# EAGLE board base (EAGLE 9.5.1)
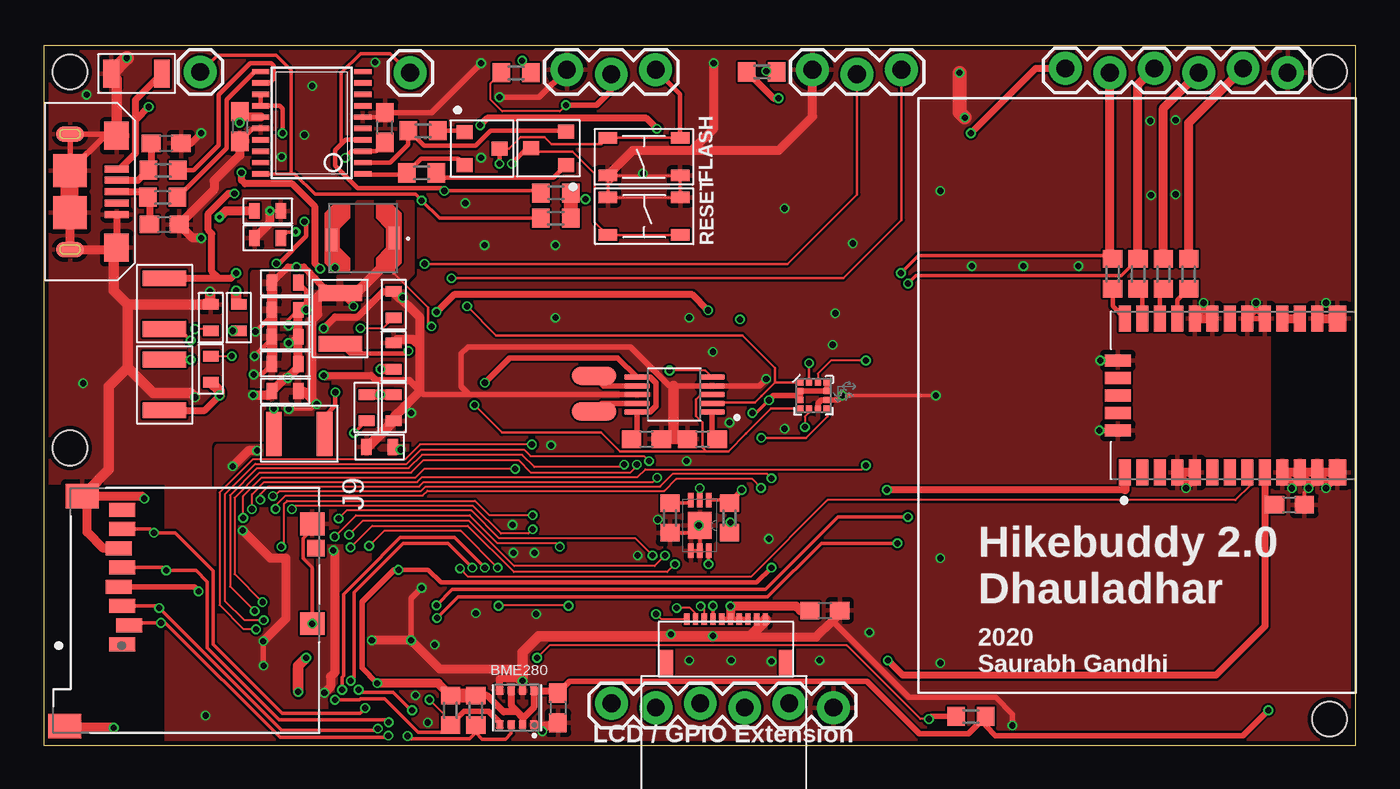
[diagram p2: board, top side]
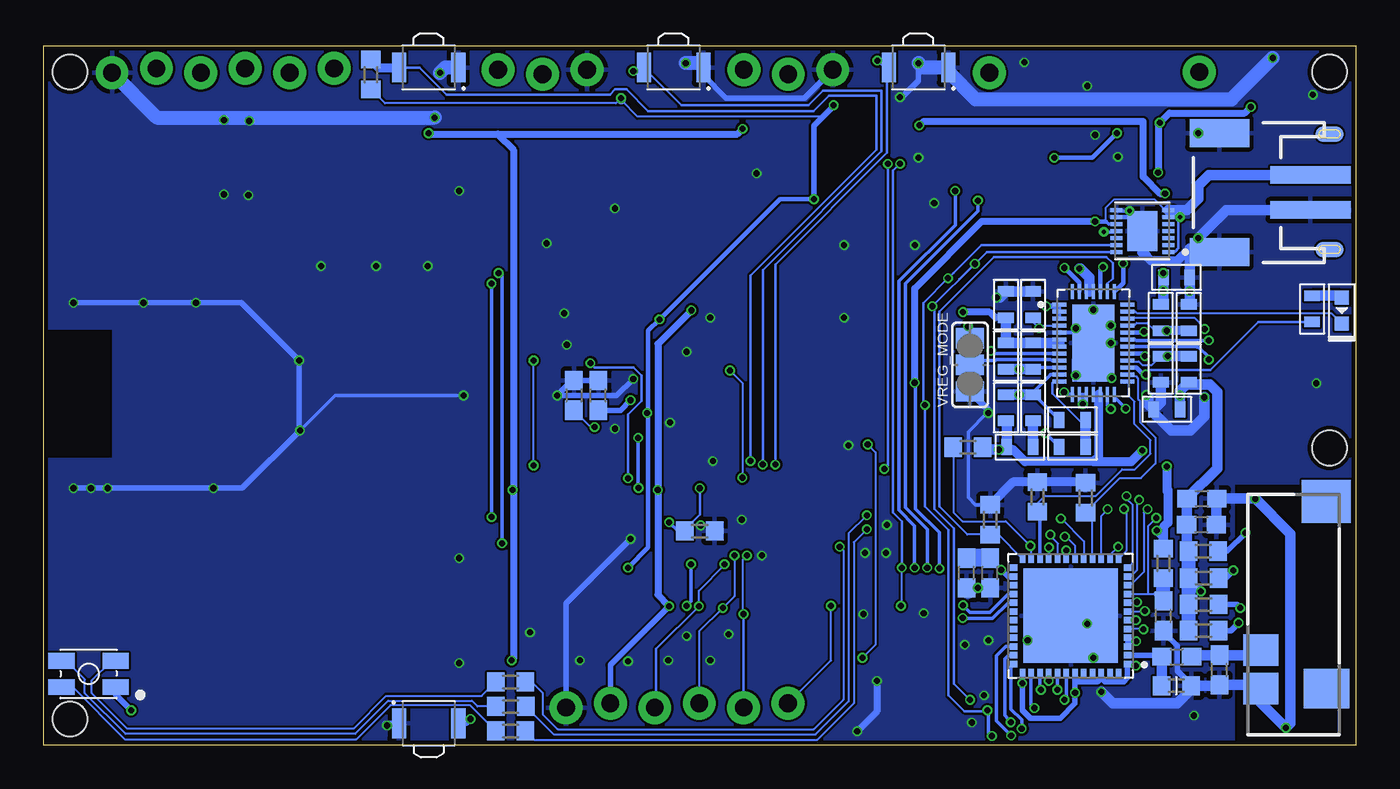
[diagram p3: board, bottom side, seen from below]

Size 75 x 40 mm. Coordinates in mm from the lower left corner, seen from the top.
Outline: 0,0 75,0 75,40 0,40 0,0
Copper layers (1*16): Top 0.035mm / dielectric 1.5mm / Bottom 0.035mm
Design rules "MF_4_mil_drill_2_Layer": minimum track width 5mil, minimum drill 4mil, track to track 5mil, track to pad 5mil, pad to pad 5mil, via to via 5mil, smd to smd 0mil, copper to edge 10mil, drill to drill 10mil, minimum pad ring 4mil, minimum via ring 4mil, stop-mask expansion 2mil, vias tented up to drill 25mil, thermal gap 10mil
Holes 2 mm at 73.5,38.5 73.5,1.5 1.5,38.5 1.5,17
tKeepout: area 71,18 to 75,22
bKeepout: area 71,18 to 75,22

## Footprints (pad centres in the part's own frame; a part is rotated, then mirrored left to right if it is on the bottom)
PRO-OB-440_1 = smd 2 x 1.8: 1 1.865,-2.65; 2 1.865,-4.85 | smd 2.6 x 2.25: 3 -1.865,-2.65 | smd 2.8 x 2.45: 4 -1.865,-13.35
JST-2-SMD = smd 1 x 4.6: 1 -1,-3.7; 2 1,-3.7 | smd 1.6 x 3.4: NC1 -3.4,1.5; NC2 3.4,1.5
PSON65P250X250X100-8N = smd 0.49 x 0.45: 1 0.97,0.975; 2 0.97,0.325; 3 0.97,-0.325; 4 0.97,-0.975; 5 -0.97,-0.975; 6 -0.97,-0.325; 7 -0.97,0.325; 8 -0.97,0.975
C0603 = smd 1.1 x 1: 1 -0.85,0; 2 0.85,0
C1206 = smd 0.9 x 1.6: P$1 -1.45,0; P$2 1.45,0
C0603' = smd 0.6 x 0.9: P$1 -0.75,0; P$2 0.75,0
LED0603 = smd 0.8 x 0.8: ANODE 0.75,0; CATHODE -0.75,0
PLCC4 = smd 1.5 x 0.9: P$1 -1.55,0.75; P$2 -1.55,-0.75; P$3 1.55,-0.75; P$4 1.55,0.75
PQFN50P700X700X104-49N = smd 0.45 x 0.35: 1 -3.265,2.75; 2 -3.265,2.25; 3 -3.265,1.75; 4 -3.265,1.25; 5 -3.265,0.75; 6 -3.265,0.25; 7 -3.265,-0.25; 8 -3.265,-0.75; 9 -3.265,-1.25; 10 -3.265,-1.75; 11 -3.265,-2.25; 12 -3.265,-2.75; 25 3.265,-2.75; 26 3.265,-2.25; 27 3.265,-1.75; 28 3.265,-1.25; 29 3.265,-0.75; 30 3.265,-0.25; 31 3.265,0.25; 32 3.265,0.75; 33 3.265,1.25; 34 3.265,1.75; 35 3.265,2.25; 36 3.265,2.75 | smd 0.35 x 0.45: 13 -2.75,-3.265; 14 -2.25,-3.265; 15 -1.75,-3.265; 16 -1.25,-3.265; 17 -0.75,-3.265; 18 -0.25,-3.265; 19 0.25,-3.265; 20 0.75,-3.265; 21 1.25,-3.265; 22 1.75,-3.265; 23 2.25,-3.265; 24 2.75,-3.265; 37 2.75,3.265; 38 2.25,3.265; 39 1.75,3.265; 40 1.25,3.265; 41 0.75,3.265; 42 0.25,3.265; 43 -0.25,3.265; 44 -0.75,3.265; 45 -1.25,3.265; 46 -1.75,3.265; 47 -2.25,3.265; 48 -2.75,3.265 | smd 5.4 x 5.4: 49 0,0
TACT4.2MM = smd 1.05 x 0.65: P$1 -2.075,1.075; P$2 2.075,1.075; P$3 -2.075,-1.075; P$4 2.075,-1.075
TSSOP20 = smd 0.305 x 0.991: 1 -2.925,-2.918; 2 -2.275,-2.918; 3 -1.625,-2.918; 4 -0.975,-2.918; 5 -0.325,-2.918; 6 0.325,-2.918; 7 0.975,-2.918; 8 1.625,-2.918; 9 2.275,-2.918; 10 2.925,-2.918; 11 2.925,2.918; 12 2.275,2.918; 13 1.625,2.918; 14 0.975,2.918; 15 0.325,2.918; 16 -0.325,2.918; 17 -0.975,2.918; 18 -1.625,2.918; 19 -2.275,2.918; 20 -2.925,2.918
MICROUSB-RIGHT = smd 0.4 x 1.35: 1 -1.3,1.27; 2 -0.65,1.27; 3 0,1.27; 4 0.65,1.27; 5 1.3,1.27 | smd 0.9 x 1.6: S1 -3.3,-1.4; S2 3.3,-1.4 | smd 1.6 x 1.4: S3 -3.2,1.27; S4 3.2,1.27 | smd 1.9 x 1.9: S5 -1.2,-1.405; S6 1.2,-1.405 | smd 0.9 x 1.6 bottom: S7 -3.3,-1.4; S8 3.3,-1.4
1X06_LOCK = drill 1.016 pad 1.88: 1 0,0; 2 2.54,-0.254; 3 5.08,0; 4 7.62,-0.254; 5 10.16,0; 6 12.7,-0.254
1X03_LOCK = drill 1.016 pad 1.88: 1 0,0.127; 2 2.54,-0.127; 3 5.08,0.127
SOLDER_PAD_2 = smd 1.016 x 2.54: P$1 -1.016,0; P$2 1.016,0
1X01 = drill 1.016 pad 1.88: 1 0,0
MOLEX_47352-1001 = smd 0.8 x 1.5: 1 1.94,-3.66; 2 0.84,-3.26; 3 -0.26,-3.66; 4 -1.36,-3.86; 5 -2.46,-3.66; 6 -3.56,-3.86; 7 -4.66,-3.66; 8 -5.76,-3.66 | smd 1.3 x 1.4: S1 -4.95,7.2; S2 0.75,7.2 | smd 1.4 x 1.9: S3 -6.55,-5.95; S4 6.6,-6.95 | smd 0.95 x 1: SW -3.56,7.4
L0603 = smd 1 x 1.1: 1 -0.85,0; 2 0.85,0
INDP_LPS4018-472MRB = smd 0.635 x 1.27: 1 -1.77,0; 2 1.81,0.1
L1210 = smd 0.9 x 2.5: P$1 -1.45,0; P$2 1.45,0
R0603 = smd 1 x 1.1: 1 -0.85,0; 2 0.85,0
R0603' = smd 0.6 x 0.9: P$1 -0.75,0; P$2 0.75,0
SW_B3U-3000P = smd 0.8 x 1.7: 1 -1.7,0; 2 1.7,0
QFN40P600X400X80-39N = smd 0.86 x 0.22: 1 -1.935,2.2; 2 -1.935,1.8; 3 -1.935,1.4; 4 -1.935,1; 5 -1.935,0.6; 6 -1.935,0.2; 7 -1.935,-0.2; 8 -1.935,-0.6; 9 -1.935,-1; 10 -1.935,-1.4; 11 -1.935,-1.8; 12 -1.935,-2.2; 20 1.935,-2.2; 21 1.935,-1.8; 22 1.935,-1.4; 23 1.935,-1; 24 1.935,-0.6; 25 1.935,-0.2; 26 1.935,0.2; 27 1.935,0.6; 28 1.935,1; 29 1.935,1.4; 30 1.935,1.8; 31 1.935,2.2 | smd 0.22 x 0.86: 13 -1.2,-2.935; 14 -0.8,-2.935; 15 -0.4,-2.935; 16 0,-2.935; 17 0.4,-2.935; 18 0.8,-2.935; 19 1.2,-2.935; 32 1.2,2.935; 33 0.8,2.935; 34 0.4,2.935; 35 0,2.935; 36 -0.4,2.935; 37 -0.8,2.935; 38 -1.2,2.935 | smd 2.4 x 4.4: 39 0,0
SON40P300X300X80-15N = smd 0.76 x 0.22: 1 -1.485,1.2; 2 -1.485,0.8; 3 -1.485,0.4; 4 -1.485,0; 5 -1.485,-0.4; 6 -1.485,-0.8; 7 -1.485,-1.2; 8 1.485,-1.2; 9 1.485,-0.8; 10 1.485,-0.4; 11 1.485,0; 12 1.485,0.4; 13 1.485,0.8; 14 1.485,1.2 | smd 1.7 x 2.3: 15 0,0
SOT-23-3 = smd 0.9 x 0.8: P$1 -1,0.95; P$2 -1,-0.95; P$3 1,0
SOP50P490X110-10N = smd 1.44 x 0.3: 1 -2.145,1; 2 -2.145,0.5; 3 -2.145,0; 4 -2.145,-0.5; 5 -2.145,-1; 6 2.145,-1; 7 2.145,-0.5; 8 2.145,0; 9 2.145,0.5; 10 2.145,1
LGA-12 = smd 0.375 x 0.35: 1 -0.75,0.75; 2 -0.75,0.25; 3 -0.75,-0.25; 4 -0.75,-0.75; 7 0.75,-0.75; 8 0.75,-0.25; 9 0.75,0.25; 10 0.75,0.75 | smd 0.35 x 0.375: 5 -0.25,-0.75; 6 0.25,-0.75; 11 0.25,0.75; 12 -0.25,0.75
DFN = smd 0.813 x 0.305: 1 -2.718,0.508; 2 -2.718,0; 3 -2.718,-0.508; 4 0.178,-0.508; 5 0.178,0; 6 0.178,0.508 | smd 1.549 x 1.346: 7 -1.27,0
FH12-10S-0.5SH = smd 0.3 x 0.655: DISP -0.25,5.25; EXTCOMIN -0.75,5.25; EXTMODE 1.25,5.25; SCLK -2.25,5.25; SCS -1.25,5.25; SI -1.75,5.25; VDD 0.75,5.25; VDDA 0.25,5.25; VSS 1.75,5.25; VSSA 2.25,5.25 | smd 0.85 x 1.5: P$1 -3.45,2.75; P$2 3.45,2.75
LCC100P960X1400X210-31N = smd 1.5 x 0.7: 1 4.4,-6.2; 2 4.4,-5.2; 3 4.4,-4.2; 4 4.4,-3.2; 5 4.4,-2.2; 6 4.4,-1.2; 7 4.4,-0.2; 8 4.4,0.8; 9 4.4,1.8; 10 4.4,2.8; 11 4.4,3.8; 12 4.4,4.8; 15 -4.4,4.8; 16 -4.4,3.8; 17 -4.4,2.8; 18 -4.4,1.8; 19 -4.4,0.8; 20 -4.4,-0.2; 21 -4.4,-1.2; 22 -4.4,-2.2; 23 -4.4,-3.2; 24 -4.4,-4.2; 25 -4.4,-5.2; 26 -4.4,-6.2 | smd 1.5 x 1: 13 4.4,5.95; 14 -4.4,5.95 | smd 0.7 x 1.5: 27 -2,-6.6; 28 -1,-6.6; 29 0,-6.6; 30 1,-6.6; 31 2,-6.6
SJ_2 = smd 1.168 x 1.6: 1 -1.524,0; 2 0,0; 3 1.524,0

## Placement (x,y rotation side)
ANT  PRO-OB-440  [PRO-OB-440_1]  3.55,0.6 180 bottom
BATTERY1  [JST-2-SMD]  6.3,31.6 90 bottom
BME280  BME280  [PSON65P250X250X100-8N]  27.05,2.15 270 top
C1  4.7pF  [C0603]  10.23,5.06 0 bottom
C2  4.7pF  [C0603]  7.8,4.3 90 bottom
C3  0.1uF  [C0603]  11,7.4 90 bottom
C4  0.1uF  [C0603]  19.5,35.32 90 top
C5  47pF  [C0603]  7,34.42 0 top
C6  47pF  [C0603]  6.89,29.78 0 top
C7  10uF  [C0603]  11.21,35.38 270 top
C8  10uF  [C0603]  22.25,9.85 90 bottom
C9  10uF  [C1206]  5.3,38.4 180 top
C10  0.1uF  [C0603']  20,25.2 270 top
C11  22uF  [C0603']  18.45,22.25 90 bottom
C12  22uF  [C0603']  13.8,26.45 180 top
C13  10pF  [C0603']  11.15,24.45 270 bottom
C14  0.1uF  [C0603]  8.8,14.1 0 bottom
C15  0.1uF  [C0603]  8.82,12.61 0 bottom
C16  10uF  [C0603']  10.25,26.75 180 bottom
C17  4.7uF  [C0603]  71.2,13.75 0 top
C18  10pF  [C0603']  9.55,21.5 90 bottom
C19  4.7uF  [C0603]  44.65,7.7 180 top
C23  10uF  [C0603]  29.39,2.14 270 top
C24  10uF  [C0603']  10.8,19.2 180 bottom
C25  1uF  [C0603']  13.8,24.9 180 top
C26  1uF  [C0603']  13.8,23.35 180 top
C27  10uF  [C0603']  13.8,21.8 180 top
C28  10uF  [C0603']  13.8,20.25 0 top
C29  22uF  [C0603']  20,25.2 270 bottom
C30  22uF  [C0603']  19.2,17.05 180 top
C31  33pF  [C0603']  18.45,19.3 270 bottom
C32  330pF  [C0603']  18.45,19.3 270 top
C33  10pF  [C0603']  16.2,18.6 0 bottom
C34  0.47uF  [C0603']  12.8,29 0 top
C35  0.1uF  [C0603']  12.8,30.55 180 top
C36  4.7uF  [C0603]  37.65,17.5 180 top
C37  4.7uF  [C0603]  34.45,17.5 180 top
C38  10uF  [C0603]  20.9,9.85 90 bottom
C39  10uF  [C0603]  43.3,20 90 bottom
C40  0.1uF  [C0603]  44.7,20 270 bottom
D1  MF-LED-0603-RED  [LED0603]  0.8,24.85 90 bottom
D4  MF-LED-3228-RGB  [PLCC4]  72.44,4.08 180 bottom
ESP32-PICO-D4  ESP32-PICO-D4  [PQFN50P700X700X104-49N]  16.3,7.4 180 bottom
FLASH  MF-SW-TACT-4.2MM  [TACT4.2MM]  34.31,33.66 0 top
FT231  FT231XS  [TSSOP20]  15.32,35.59 90 top
J1  MF-CON-MICROUSB-RIGHT  [MICROUSB-RIGHT]  2.9,31.65 270 top
J2  GPS Port  [1X06_LOCK]  71.1,38.45 180 top
J3  [1X03_LOCK]  43.95,38.5 0 top
J4  [1X03_LOCK]  29.9,38.5 0 top
J5  SOLDER_PAD_2  [SOLDER_PAD_2]  31.45,20.1 270 top
J6  [1X01]  8.95,38.5 0 top
J7  [1X01]  20.95,38.45 0 top
J8  [1X06_LOCK]  45.15,2.15 180 top
J9  47352-1001  [MOLEX_47352-1001]  8.15,7.7 270 top
L1  30Ω/1.8A  [L0603]  10.26,3.4 0 bottom
L2  3.3uH  [INDP_LPS4018-472MRB]  18.25,29 180 top
L3  2.2uH  [L1210]  14.6,17.8 0 top
L4  4.7uH  [L1210]  6.9,25.25 270 top
L5  2.2uH  [L1210]  16.95,24.4 90 top
L6  4.7uH  [L1210]  6.9,20.6 270 top
R1  10k  [R0603]  11,10.4 90 bottom
R2  10k  [R0603]  22.18,17.04 0 bottom
R3  27  [R0603]  6.83,32.88 0 top
R4  27  [R0603]  6.79,31.34 0 top
R5  10k  [R0603]  21.68,35.14 0 top
R6  10k  [R0603]  21.61,32.73 0 top
R7  2K  [R0603']  9.55,24.45 270 top
R8  3K  [R0603']  18.45,25.2 270 bottom
R9  560K  [R0603']  20,22.25 90 bottom
R10  1k  [R0603]  29.28,31.57 0 top
R11  1k  [R0603]  29.27,30.14 0 top
R12  10k  [R0603]  8.7,6.55 180 bottom
R13  10k  [R0603]  8.7,8.05 180 bottom
R14  10k  [R0603]  8.7,9.55 180 bottom
R15  100  [R0603]  62.55,26.95 270 top
R17  100  [R0603]  61.1,26.95 90 top
R18  100  [R0603]  65.45,26.95 90 top
R19  100  [R0603]  64,26.95 90 top
R20  100K  [R0603']  20,22.25 270 top
R21  1K  [R0603']  2.5,24.95 270 bottom
R22  220K  [R0603']  9.55,24.45 90 bottom
R23  680K  [R0603']  11.15,24.45 270 top
R24  220K  [R0603']  11.15,21.5 270 bottom
R25  680K  [R0603']  9.55,21.5 90 top
R26  680K  [R0603']  20,19.3 270 bottom
R27  220K  [R0603']  20,19.3 90 top
R28  121K  [R0603']  19.2,17.05 180 bottom
R29  15K  [R0603']  16.2,17.05 0 bottom
R30  10k  [R0603]  18.2,14.2 270 bottom
R31  10k  [R0603]  15.45,14.15 270 bottom
R32  10k  [R0603]  53,1.65 0 top
R33  10k  [R0603]  56.3,38.35 270 bottom
R34  10k  [R0603]  27,38.45 180 top
R35  10k  [R0603]  41.05,38.5 180 top
R36  10k  [R0603]  20.9,12.9 270 bottom
R37  2K  [R0603]  23.25,2 90 top
R38  2K  [R0603]  24.7,2 90 top
R39  750K  [R0603]  35.8,13 270 top
R40  1k  [R0603]  48.31,3.62 180 bottom
R41  1k  [R0603]  48.31,0.82 180 bottom
R42  1k  [R0603]  48.3,2.22 180 bottom
R43  10k  [R0603]  8.72,11.1 180 bottom
R44  560K  [R0603]  39.2,13 270 top
R45  100K  [R0603]  37.5,12.25 0 bottom
RESET  MF-SW-TACT-4.2MM  [TACT4.2MM]  34.32,30.25 180 top
S1  B3U-3000P  [SW_B3U-3000P]  53,1.25 0 bottom
S2  B3U-3000P  [SW_B3U-3000P]  53,38.75 180 bottom
S3  B3U-3000P  [SW_B3U-3000P]  25,38.75 180 bottom
S4  B3U-3000P  [SW_B3U-3000P]  39,38.75 180 bottom
U1  LTC3586EUFE-1#PBF  [QFN40P600X400X80-39N]  15,23 0 bottom
U2  MAX17260SETD+  [SON40P300X300X80-15N]  12.2,29.4 180 bottom
U3  MF-DSC-SOT233-MMBT3904  [SOT-23-3]  25.05,34.12 0 top
U4  MF-DSC-SOT233-MMBT3904  [SOT-23-3]  28.86,34.13 180 top
U5  DRV2605LTDGSRQ1  [SOP50P490X110-10N]  36.05,20.05 180 top
U7  LSM303CTR  [LGA-12]  44,20 0 top
U9  LTC6991CDCB#TRMPBF  [DFN]  37.5,11.3 270 top
U$5  51441-1093  [FH12-10S-0.5SH]  39,1.95 0 top
UBLOX_GPS  CAM-M8C-0  [LCC100P960X1400X210-31N]  68,20 270 top
VREG_MODE  VREG MODE  [SJ_2]  22.05,21.75 90 bottom

## Tracks (layer width: path | path; a pad name or v marks a point on that pad's centre or on a via)
3V3_GPS  (via drill 0.35)
  Top 0.2: 70.3,13.7 C17.1
  Top 0.305: 69.8,14.2 70.3,13.7
  Top 0.406: L4.P$1 10,26.7 | 10,26.7 10.7,26.7 v11,27 | 10,26.7 9.61,27.09 9.61,29.25 9.4,29.46 9.4,30.41 10.54,31.55 v10.9,31.55 | v53,35 56.7,38.7 J2.6 | v24.95,35.45 25.35,35.85 34.45,35.85 v35.05,35.25 | UBLOX_GPS.9 69.8,14.2 69.8,6.8 67,4 49.1,4 v48.25,4.85 | 61.8,14.6 v48.2,14.6
  Top 0.508: UBLOX_GPS.1 61.8,14.6
  Top 0.61: R23.P$1 11,25.35 v11,26
  Bottom 0.305: 48.15,14.55 v48.2,14.6 48.15,14.65 | 52.95,34.95 49.05,34.95
  Bottom 0.406: v11,27 C16.P$2 | v10.9,31.55 11.2,31.55 12.15,32.5 12.15,35.66 24.7,35.66 24.91,35.45 v24.95,35.45 | v53,35 52.95,34.95 35.35,34.95 v35.05,35.25 | 48.15,14.55 48.15,4.95 v48.25,4.85 | 48.15,14.65 48.15,34.05 49.05,34.95
  Bottom 0.61: C16.P$2 v11,26 11,25.35 R23.P$1
3V3_SDC  (via drill 0.35)
  Top 0.305: J9.4 8.59,9.06 v8.85,8.8
  Top 0.406: L6.P$2 9.2,19.15 v10.05,20
  Top 0.61: R25.P$1 10.05,20.25 v10.05,20
  Bottom 0.508: v8.85,8.8 9.05,9 9.55,9
  Bottom 0.61: v10.05,20 C24.P$1 10.05,20.25 R25.P$1 9.44,20.64 8.35,20.64 7.91,20.2 7.91,15.84 C14.1 9.65,12.63 C15.1 9.67,11.2 9.55,11.08
  Bottom 0.813: R12.2 R13.2 9.55,9 R14.2 9.55,11.08 R43.2
ACCL1  (via drill 0.35)
  Top 0.127: v13.25,13.52 13.25,13.7 13.83,14.28 21.67,14.28 21.93,14.54 35.48,14.54 36.15,15.22 40.5,15.22 v41,14.72
  Top 0.152: v41.02,17.58 43.58,17.58 44.8,18.8 U7.7
  Bottom 0.127: ESP32-PICO-D4.13 13.1,11.11 13.1,13.37 v13.25,13.52
  Bottom 0.203: v41.02,17.58 41.02,14.74 v41,14.72
ACCL2  (via drill 0.35)
  Top 0.127: v13.1,14.25 13.2,14.25 13.49,14.54 21.57,14.54 21.82,14.8 35.23,14.8 35.95,15.51 41.35,15.51 v41.6,15.26
  Top 0.15: v43.75,21.85 U7.12
  Bottom 0.127: ESP32-PICO-D4.12 12.78,10.4 12.78,13.78 13.1,14.1 v13.1,14.25
  Bottom 0.15: v41.6,15.26 41.6,18.91 40.82,19.69 40.82,21.15 41.27,21.6 43.5,21.6 v43.75,21.85
D+
  Top 0.406: J1.3 5.63,31.65 R4.1 6.04,31.24 C6.1
D-
  Top 0.406: J1.2 5.4,32.3 R3.1 6.14,33.05 C5.1
EN_GPS
  Bottom 0.127: U1.21 12.97,21.1 12.57,21.1 12.44,20.97 12.44,19.8 12.34,19.7 12.34,18.49 11.45,17.6 11.45,16.1 12.28,15.28 13.47,15.28 R31.2 15.05,12.9 ESP32-PICO-D4.16
EN_LCD
  Bottom 0.127: ESP32-PICO-D4.24 20.43,12.05 R36.2 22.2,12.05 23.8,13.65
  Bottom 0.15: 23.8,24.8 23.8,13.65
  Bottom 0.152: U1.33 14.2,26.39 13.9,26.68 13.9,27.57 14.25,27.92 20.68,27.92 23.8,24.8
EN_SDC
  Bottom 0.127: U1.20 13,20.73 13,20 12.65,19.65 12.65,18.37 11.73,17.45 11.73,16.66 12.62,15.77 13.36,15.77 14.87,14.26 17.76,14.26 18.2,13.82 R30.2
  Bottom 0.203: ESP32-PICO-D4.22 18.05,13.2 R30.2
ESP_EN  (via drill 0.35)
  Top 0.127: v11.4,13 11.4,14.25 12.45,15.3 21.25,15.3 21.75,15.8 v26.95,15.8
  Top 0.15: U4.P$3 28.05,33.93 30.24,33.93 31.49,32.68 31.49,29.93 RESET.P$2 RESET.P$1
  Top 0.254: U4.P$3 27.63,34.13 v26.75,33.25
  Bottom 0.127: ESP32-PICO-D4.9 11.85,8.65 | 11.85,8.65 11.39,8.65 | v11.4,13 11.85,12.55 11.85,8.65
  Bottom 0.15: v26.75,33.25 26.75,16 v26.95,15.8
  Bottom 0.305: 11.39,8.65 C3.2
  Bottom 0.813: C3.2 R1.1
ESP_FLASH  (via drill 0.35)
  Top 0.127: v25.95,10.15 23.85,12.25 19.45,12.25 v18.6,11.4 | v30,7.97 29.97,8 26,8 v26,7.97
  Top 0.15: U3.P$3 26.61,34.12 27.27,34.78 28.64,34.78 29.04,34.38 31.88,34.38 FLASH.P$1 FLASH.P$2
  Top 0.254: U3.P$3 v26.05,33.26 v26.05,33.25 | FLASH.P$2 36.38,37.22 J4.3
  Bottom 0.127: ESP32-PICO-D4.23 18.55,11.35 v18.6,11.4 20.01,12.81 22.48,12.81 22.99,13.32 22.99,17 R2.1 | J8.6 30,4.85 v30,7.97 | v26,7.97 25.95,8.02 v25.95,10.15
  Bottom 0.15: v26.05,33.25 26.45,32.85 26.45,13.3 25.95,12.8 v25.95,10.15
ESP_RX  (via drill 0.35)
  Top 0.2: FT231.20 14.34,32.66 15.5,31.5 21.25,31.5 v21.6,31.15 22.61,30.14 R11.1 | 19,10 20.55,11.55 23.1,11.55 v24.5,10.15
  Top 0.203: v17.55,3.68 17.75,3.88 17.75,8.75 19,10 | J6.1 9,38.5 9.95,39.46 13.3,39.46 14.15,38.6 14.15,32.66 FT231.20
  Bottom 0.2: v21.6,31.15 21.6,30.55 25.75,26.4 25.75,13.6 24.5,12.35 v24.5,10.15
  Bottom 0.203: ESP32-PICO-D4.40 v17.55,3.68
ESP_TX  (via drill 0.35)
  Top 0.127: 22.75,31.85 v22.9,31.7
  Top 0.2: 18.25,9.75 20.38,11.88 23.49,11.88 v25.21,10.15 | v22.9,31.7 28.3,31.7 R10.1
  Top 0.203: 17,34.37 17,38.45 18.11,39.55 19.81,39.55 20.91,38.45 J7.1 | 18.25,9.75 17.13,8.63 17.13,3.98 17.05,3.89 17.05,3.47 17.05,3.46 v17.05,3.17
  Top 0.254: 22.75,31.85 17.95,31.85 16.65,33.15 16.65,34.02 17,34.37 17.24,34.61 FT231.4
  Bottom 0.2: v22.9,31.7 22.9,29.75 26.12,26.54 26.12,13.45 25.21,12.55 v25.21,10.15
  Bottom 0.203: ESP32-PICO-D4.41 17.05,3.9 17.05,3.89 17.05,3.18 v17.05,3.17
GND  (via drill 0.25 pad 0.55, 0.35)
  Top 0.127: U$5.VSS U$5.VSSA
  Top 0.15: FLASH.P$3 32.24,32.57 32.24,32 | 32.24,32 RESET.P$4 RESET.P$3 36.38,31.34 FLASH.P$4 32.82,32.58 32.24,32
  Top 0.2: C26.P$1 14.35,23.35 v14,23 | C25.P$1 14,24.35 v14,24 | v45.65,20 v51,20 | C17.2 72.05,14.45 v72.3,14.7
  Top 0.203: v12.93,30.55 C35.P$1 | U9.7 U9.5 U9.4 | U9.7 v37.45,12.57 | R39.2 37.08,12.15 U9.7 | J9.S1 15.35,12.36 14.82,11.83 14.82,10.69 15.35,10.16 J9.S2
  Top 0.254: C12.P$1 15,26 v15,24.9 | FT231.16 11.94,35.26 C7.2 | C4.2 19.25,35.91 FT231.6
  Top 0.305: 24.31,20.05 23.86,20.51 23.86,22.39 24.24,22.78 33.53,22.78 35.76,20.55 36,20.55 U5.4 40.9,20.55 v41.3,20.95 | U5.8 24.31,20.05 | 24.31,20.05 21.73,20.05 21.51,20.27 | 40.38,6.24 40.38,6.19 | v55.38,1.12 55.38,1.77 54.42,2.73 49.47,2.73 45.08,7.12 | UBLOX_GPS.22 66.3,24.9 | 66.3,24.9 v66.3,25.3 | UBLOX_GPS.21 66.3,24.9 | 69.3,24.9 UBLOX_GPS.19 UBLOX_GPS.18 69.3,24.9 | 69.3,24.9 v69.3,25.3 | UBLOX_GPS.13 73.95,15.35 v73.3,14.7 73.3,15.1 UBLOX_GPS.12 72.8,15.2 v72.3,14.7 72.3,15.1 UBLOX_GPS.11 71.8,15.15 v71.35,14.7 71.35,15.05 UBLOX_GPS.10 | UBLOX_GPS.5 65.8,15.2 v65.3,14.7 65.3,15.1 UBLOX_GPS.4 | UBLOX_GPS.31 v60.35,18 | UBLOX_GPS.27 v60.4,22 | J1.S5 3.6,34.95 | 3.6,34.95 4.07,34.95 | J1.S5 J1.S1 3.6,34.95 | v26.05,37.05 28.33,37.05 J4.1 | C4.2 22.17,36.17 v25,39 | v21.6,9 21,8.4 v21,6 | v45.65,20 45.4,19.75 U7.8 44.46,19.75 44.25,19.54 U7.6
  Top 0.406: J1.5 J1.S4 | C5.2 8.42,34.42 v9,35 | v16,23.84 16.65,24.49 17.95,24.49 19.41,25.95 C29.P$1 | v16,21.15 18.7,21.15 18.99,20.86 20.91,20.86 21.51,20.27 | v21,19 20.62,19.38 | C23.2 29.28,1.18 28.88,1.18 | BME280.5 26.05,3.14 26.05,3.8 27.05,3.8 27.37,3.48 BME280.7 v27.37,3.67 v27.38,3.68 | v28.5,0.8 28.88,1.18 | BME280.1 28.88,1.18
  Top 0.508: C34.P$1 12.93,29.88 v12.93,30.55 | v9,29 8.52,29 C6.2 9.74,31.77 9.74,32.27 11.21,33.73 C7.2 | 21.51,22.82 21.12,23.21 20.21,23.21 R20.P$1 | R27.P$1 20,18.76 20.62,19.38 21.51,20.27 21.51,22.82 | 21.51,22.82 21.51,24.44 C29.P$1 | v15,24.9 C25.P$1 C26.P$1 C27.P$1 14.55,21.6 v13.95,21 13.8,21 C28.P$1 | UBLOX_GPS.22 UBLOX_GPS.21 | UBLOX_GPS.15 UBLOX_GPS.14 | UBLOX_GPS.13 UBLOX_GPS.12 UBLOX_GPS.11 UBLOX_GPS.10 | UBLOX_GPS.5 UBLOX_GPS.4 | v18.76,6 v21,6 22.65,4.35 26.69,4.35 v27.37,3.67 | v11.97,20.03 12.83,20.03 | 4.07,28.35 J1.S2 J1.S6 | C19.1 45.5,7.55 45.08,7.12 44.14,6.19 40.38,6.19 | FLASH.P$3 33.68,34.02 37.07,34.02 | v38.3,39 38.3,35.26 37.07,34.02 | 37.07,34.02 42.02,34.02 43.95,35.95 J3.1 | J9.S3 5.6,14.25 v5.75,14.1 | J9.6 3.4,11.26 2.48,12.19 2.48,14.53
  Top 0.61: v9.5,25.95 9.5,25.25 R22.P$2 4.8,25.2 | R27.P$1 18.5,17.05 C30.P$2 | C9.P$2 4.17,38.08 J1.S3 | 4.8,25.2 4,26 4,28.28 4.07,28.35 | 4.8,25.2 4.8,21.6 | v8.65,19.9 8.4,20.15 6.25,20.15 4.8,21.6 | 12.83,20.03 C28.P$1 | v20.52,25.6 20.35,25.6 C29.P$1 | 4.8,21.6 3.71,20.51 3.71,15.76 2.48,14.53 J9.S3 | v14.55,3.05 14.55,4.55 v15,5 | v27.38,3.68 27.38,5.33 28.29,6.24 40.38,6.24 41.25,7.11 U$5.VSSA | C37.1 36,17.5 | 36,17.5 C36.2 | 36,17.5 36,20.55 | v4,1 1.3,1 J9.S4
  Top 0.813: C9.P$2 v4.75,39.3 | v52.35,38.45 52.35,36.19 v52.65,35.89
  Top 1.016: 4.07,34.95 J1.S3 | 4.07,28.35 J1.S4 | J1.S6 J1.S5
  Bottom 0.2: v14,23 U1.39 | v51,20 58.35,20 v60.35,18
  Bottom 0.203: 12.25,29.45 12.93,30.13 v12.93,30.55 13.63,30.55 U2.8 | U1.5 16.3,23.6 v15,24.9 U1.39 | R36.1 21.75,13.75 22.16,14.16 22.16,17.92 21.07,19 20.95,19.12 | R45.2 36.97,12.57 v37.45,12.57
  Bottom 0.254: U2.15 12.25,29.45 13,30.2 U2.9
  Bottom 0.305: C3.1 11,6.46 10.21,5.67 10.21,4.24 9.41,3.44 L1.2 | v41.3,20.95 42.25,20 v45.65,20 44.8,20.85 C40.1 C39.2 | S1.1 55.5,1.25 v55.38,1.12 | v73.3,14.7 v72.3,14.7 v71.35,14.7 v65.3,14.7 63.65,14.7 v60.35,18 60.4,18.05 v60.4,22 63.7,25.3 v66.3,25.3 v69.3,25.3 v73.3,25.3 | v25,39 25,38 26,37 v26.05,37.05 | J4.1 31.53,37 36,37 37.3,38.3 S4.1 | J8.1 45.15,8.1 v41.45,11.8 | C38.1 v21.6,9 C8.1
  Bottom 0.406: VREG_MODE.1 20.95,19.12 | v21,19 21.07,19 | v28.5,0.8 27.38,1.92 v27.38,3.68
  Bottom 0.508: 9.5,28.4 10.19,27.71 11.71,27.71 12,28 | R31.1 15.5,15.05 R30.1 19.6,15.05 R36.1 | v18.76,6 17.36,7.4 ESP32-PICO-D4.49 15.8,7.4 J9.S2 | 11.85,19.95 11.93,20.03 v11.97,20.03 | U1.39 16,22 v16,21.15
  Bottom 0.61: v9.5,25.95 C16.P$1 | R22.P$2 9.5,25.25 C16.P$1 | R24.P$2 11.15,19.6 C24.P$2 | R8.P$1 C29.P$1 20.35,25.6 v20.52,25.6 | U2.15 12.2,28.2 12,28 | 9.5,28.4 C16.P$1 | C24.P$2 11.55,19 10.55,18 9.45,18 8.65,18.8 v8.65,19.9 | C24.P$2 11.85,19.5 11.85,19.95 | C15.2 7.97,14.08 C14.2 v5.75,14.1 3.73,12.08 3.73,1.27 v4,1 5.42,2.42 ANT.1 5.62,3.45 C2.1 7.85,3.4 L1.2 9.41,3.2 10.21,2.4 13.9,2.4 v14.55,3.05 | v15,5 15,6.1 ESP32-PICO-D4.49 | BATTERY1.1 7.4,30.6 v9,29
  Bottom 0.813: v4.75,39.3 7.11,36.94 21.74,36.94 23.3,38.5 S3.1 24.75,38.75 v25,39 | S4.1 37.3,39 v38.3,39 | v52.35,38.45 52.05,38.75 S2.1 | v52.65,35.89 68.54,35.89 J2.1
  Bottom 1.016: C8.1 22.16,8.91
  other vias: 51.25,4.7 59.15,27.4 56,27.4 53.05,27.4 63.25,35.7 63.3,31.45 64.7,31.5 64.7,35.75 51.25,10.7 51.25,31.7 46.25,28.7 45.25,24.7 24.7,7.55 34.25,32.7 29.25,24.45 25.2,28.6 22.35,5.75 9.25,1.7 2.25,20.7 2.45,37.2 18.95,39.05 29.25,28.6 47.2,6.45 28.15,7.5 35.1,12.9 38.25,22.5 36.9,24.45 42.35,30.7 24.1,31 25,33.6 38.25,6.25 35.85,6.35 36.9,4.85 39.3,4.85 41.6,4.8 44.35,4.85 29,17.15 33.95,10.85 28.05,11 26.85,11 26.8,12.6 36.75,16.25 15.35,37.7 13.6,33.65 14.9,34.9 21.25,2.85 21.95,1.3 45.1,22.9 42.35,18.1 39.2,18.45 15.35,6.95
  pour Bottom: 13.5,30.2 11.5,30.2 11.5,30.6 13.5,30.6
  pour Top (rank 6): 75,40 0,40 0,15 7,15 7,0 75,0 75,16.35 71,16.35 71,23.85 75,23.85
  pour Bottom (rank 6): 75,40 0,40 0,15 7,15 7,0 75,0 75,16.35 71,16.35 71,23.85 75,23.85
GPS_RESET
  Top 0.508: R18.2 65.45,35.59 J2.2
GPS_RX  (via drill 0.35)
  Top 0.2: R17.2 60.9,28 50,28 v49,27 | v48.8,11.55 44.45,11.55 41.38,8.47 23.68,8.47 v22.48,7.28
  Top 0.508: R17.2 60.94,27.96 J2.5
  Bottom 0.2: v22.48,7.28 22.45,7.25 20.77,7.25 19.86,8.15 ESP32-PICO-D4.29 | v49,27 48.95,27 48.8,26.85 v48.8,11.55
GPS_SAFEBOOT
  Top 0.508: R19.2 64,36.43 J2.3
GPS_TX  (via drill 0.35)
  Top 0.2: R15.1 61.6,26.85 49.86,26.85 v49.41,26.4 | v49.4,13.05 45.4,13.05 41.25,8.9 23.35,8.9 v22.45,8
  Top 0.508: R15.1 62.55,37.77 J2.4
  Bottom 0.2: v22.45,8 22.05,7.6 20.91,7.6 19.86,8.65 ESP32-PICO-D4.28 | v49.4,13.05 v49.41,13.05 v49.41,26.4
HAP_EN  (via drill 0.35)
  Top 0.127: v12.38,14.03 12.38,14.33 12.84,14.79 21.46,14.79 21.72,15.05 34.82,15.05 v35.07,15.3 | U5.5 37.82,21.43 v35.77,21.43
  Bottom 0.127: ESP32-PICO-D4.11 13.02,9.63 12.89,9.63 12.52,10.01 12.52,13.89 v12.38,14.03 | v35.77,21.43 35.07,20.73 v35.07,15.3
I2C_SCL  (via drill 0.35)
  Top 0.15: U5.2 38.24,19.6 40.65,19.6 41.02,19.98 | 39.93,23.44 25.86,23.44 v24.2,25.1 | v21.77,27.52 42.52,27.52 46.49,31.49 J3.2
  Top 0.152: v22.05,2.6 22.85,1.8 22.85,0.75 | U7.1 41.8,20.75 | 41.02,19.98 41.8,20.75 | 41.8,20.75 41.8,21.57 39.93,23.44
  Top 0.203: v16.65,2.6 18.05,2.6 18.11,2.66 19.49,2.66 21.4,0.75 22.85,0.75 R37.1
  Top 0.305: BME280.4 26.05,1.2 26.05,1.3 25.42,1.93 24.03,1.93 R37.1
  Bottom 0.15: v24.2,25.1 24.1,25 | 22.65,26.65 v21.77,27.52
  Bottom 0.152: U2.14 21.1,28.2 22.65,26.65 | v21.77,27.52 v24.2,25.1 | v22.05,2.6 22.98,3.53 22.98,12.4 24.1,13.52 24.1,25
  Bottom 0.203: ESP32-PICO-D4.42 16.55,2.7 v16.65,2.6
I2C_SDA  (via drill 0.35)
  Top 0.15: U5.3 38.15,20 37.51,20 37.27,19.76 37.27,18.84 37.65,18.46 37.65,17.02 37.87,16.8 | 37.87,16.8 39.13,16.8 40.15,17.82 | 37.87,16.8 32.93,16.8 31.85,17.88 26.19,17.88 v24.62,19.45 | v23.3,26.7 45.7,26.7 49.03,30.03 J3.3
  Top 0.152: U7.4 41.59,19.25 40.15,17.82
  Top 0.2: BME280.3 26.72,0.68 26.4,0.35 25.05,0.35 24.7,0.7 R38.1
  Top 0.203: v18,3.17 18.14,3.02 19.98,3.02 21,2 v21.05,2 | R38.1 24.7,0.75 24.33,0.38 20.95,0.38 v20.8,0.53
  Bottom 0.15: 23,27 v23.3,26.7
  Bottom 0.152: U2.13 21.41,28.6 23,27 | v23.3,26.7 24.72,25.29 24.72,19.55 v24.62,19.45 24.62,13.65 23.28,12.3 23.28,2.85 22.37,1.95 21,1.95
  Bottom 0.203: ESP32-PICO-D4.39 18.05,3.9 18.05,3.89 18.05,3.23 v18,3.17 | v21.05,2 21,1.95 21,0.73 v20.8,0.53
JUMPER
  Bottom 0.2: 20.55,22.06 20.6,22.01 21.79,22.01 VREG_MODE.2
  Bottom 0.203: U1.9 17.39,22 17.44,22.06 20.55,22.06
LCD_CLK  (via drill 0.35)
  Top 0.127: U$5.SCLK 35.3,7.2 v35,7.5 | v16.85,12.96 17.3,13.41 24.45,13.41 26.03,11.83 33.82,11.83 v34.8,10.85
  Bottom 0.127: ESP32-PICO-D4.17 15.53,10.68 15.53,11.66 16.83,12.96 v16.85,12.96 | v34.8,10.85 35.05,10.6 35.05,7.55 v35,7.5
  Bottom 0.152: v35,7.5 J8.5
LCD_CS  (via drill 0.35)
  Top 0.127: v17.54,11.31 18.77,12.55 24.23,12.55 26.88,9.9 35.63,9.9 v36.08,10.35 | U$5.SCS 37.75,7.75 v37.55,7.95
  Bottom 0.127: ESP32-PICO-D4.21 17.52,10.7 17.52,11.29 v17.54,11.31 | v36.08,10.35 36.08,10.3 37.55,8.83 v37.55,7.95
  Bottom 0.152: v37.55,7.95 40,5.5 40,2.22 J8.3
LCD_MOSI  (via drill 0.35)
  Top 0.127: v17.45,12.04 18.26,12.85 24.29,12.85 26.89,10.25 34.92,10.25 v35.52,10.85 | U$5.SI 37.25,7.55 36.95,7.85 v36.18,7.85
  Bottom 0.127: ESP32-PICO-D4.20 17.02,10.7 17.02,11.54 17.45,11.97 v17.45,12.04 | v35.52,10.85 35.52,8.51 v36.18,7.85 37.53,6.5 J8.4
LED1  (via drill 0.35)
  Top 0.127: v16.63,11.92 17.85,13.15 24.35,13.15 25.95,11.55 29.3,11.55 v29.5,11.35
  Bottom 0.127: ESP32-PICO-D4.18 16.05,11.42 16.55,11.92 v16.63,11.92 | v29.5,11.35 29.3,11.15 29.3,2.6 30.98,0.92 45.62,0.92 46.48,1.78 46.48,2.99 47.12,3.62 R40.1
LED2  (via drill 0.35)
  Top 0.127: v27.95,12.35 27.7,12.1 26.13,12.1 24.55,13.68 14.37,13.68 v14.19,13.5
  Bottom 0.127: ESP32-PICO-D4.15 14.57,10.68 14.57,13.08 14.16,13.48 v14.19,13.5 | R41.1 46.97,0.32 30.78,0.32 28.7,2.4 28.7,11.6 v27.95,12.35
LED3  (via drill 0.35)
  Top 0.127: v13.58,11.35 13.6,11.35 13.72,11.47 13.72,13.8 13.9,13.98 24.66,13.98 25.49,13.15 v27.95,13.15
  Bottom 0.127: v13.58,11.35 14.05,10.88 ESP32-PICO-D4.14 | R42.1 45.85,0.62 30.88,0.62 29,2.5 29,12.1 v27.95,13.15
MAGDRDY  (via drill 0.35)
  Top 0.127: v11.9,13.5 11.9,14.35 12.6,15.05 21.36,15.05 21.64,15.33 33.94,15.33 34.39,15.78 46.78,15.78 v47,16 | v47,22 45,22 44.25,21.25 U7.11
  Bottom 0.127: ESP32-PICO-D4.10 13,9.18 12.84,9.18 12.12,9.91 12.12,13.28 v11.9,13.5 | v47,16 v47,22
N$1
  Bottom 0.305: ESP32-PICO-D4.2 11.17,5.15 C1.1
  Bottom 0.61: C1.1 11.08,3.43 L1.1
N$2
  Bottom 0.61: ANT.2 5.71,5.15 C2.2 9.29,5.15 C1.2
N$3
  Top 0.254: R5.2 23.98,35.14 U3.P$1
N$4
  Top 0.254: U4.P$1 29.14,32.46 22.72,32.46 R6.2
N$5  (via drill 0.35)
  Top 0.254: FT231.13 FT231.14 13.49,36.56 13.65,36.4 v13.65,35 | v17.24,33.59 17.61,33.96 FT231.3 19,33.96 C4.1
  Bottom 0.254: v17.24,33.59 15.06,33.59 v13.65,35
N$6
  Top 0.254: R3.2 8.56,32.88 10,34.31 10,37.2 11.8,39 13,39 13.15,38.85 13.15,38.11 12.9,37.86 FT231.12
N$7
  Top 0.254: R4.2 10.45,34.14 10.45,36.92 12.05,38.52 FT231.11
N$8
  Top 0.254: FT231.2 19.81,33.31 20.84,34.34 R5.1 20.88,35.14 21.73,34.28 24.68,34.28 25.53,35.14 29.8,35.14 U4.P$2
N$9
  Top 0.254: FT231.1 18.28,32.63 20.66,32.63 R6.1 21.56,33.53 23.69,33.53 U3.P$2
N$10  (via drill 0.35)
  Top 0.127: R7.P$2 9.45,23.8 v8.65,23.8
  Bottom 0.127: U1.29 13.02,24.45 9.23,24.45 8.65,23.87 v8.65,23.8
N$11  (via drill 0.35)
  Top 0.127: v18.1,23.85 19.4,23.85 C10.P$2
  Bottom 0.127: U1.4 17.95,24 v18.1,23.85 18.45,24.2 R8.P$2
N$12  (via drill 0.35)
  Top 0.61: R9.P$1 v19.25,21.5
  Bottom 0.203: U1.10 18.35,21.6
  Bottom 0.254: 18.35,21.6 C11.P$1
  Bottom 0.61: R9.P$1 v19.25,21.5 C11.P$1
N$13  (via drill 0.35)
  Top 0.254: v16.67,20.18 16.67,19.43 16.1,18.86 16.1,17.85 L3.P$2
  Bottom 0.254: U1.13 16.79,20.07 v16.67,20.18
N$14  (via drill 0.35)
  Top 0.61: R27.P$2 v19.25,20.05 C32.P$1
  Bottom 0.203: U1.11 17.43,21.2 17.45,21.19 17.44,21.19 18.45,20.18 C32.P$1 18.4,20.05 C33.P$1
  Bottom 0.61: C32.P$1 v19.25,20.05 R27.P$2
N$15  (via drill 0.35)
  Top 0.254: L2.2 16.65,28.69 v16.65,27.3
  Bottom 0.254: U1.37 15.8,26.45 v16.65,27.3
N$16
  Bottom 0.127: U1.30 12.62,24.8 12.48,24.7 1.4,24.7 D1.CATHODE
N$17
  Bottom 0.61: D1.ANODE 0.9,25.7 R21.P$1
N$18  (via drill 0.35)
  Top 0.203: v13.15,19.25 L3.P$1
  Bottom 0.203: U1.19 13.8,19.9 v13.15,19.25
N$20  (via drill 0.35)
  Top 0.2: 7.75,23.8 L4.P$2
  Top 0.203: v8.4,23.15 7.75,23.8
  Bottom 0.2: U1.26 12.62,23.2 12.54,23.14 | 8.43,23.14 v8.4,23.15
  Bottom 0.203: 12.54,23.14 8.43,23.14
N$21  (via drill 0.35)
  Top 0.127: C13.P$2 v10.8,23.7
  Bottom 0.127: U1.28 12.66,24 12.52,24.15 11.94,24.15 11.49,23.7 C13.P$2 v10.8,23.7
  Bottom 0.508: R22.P$1 v10.8,23.7
N$22  (via drill 0.35)
  Top 0.254: v20.85,22.55 20.7,22.4 17.5,22.4 L5.P$1
  Bottom 0.203: 20.7,22.4 U1.8
  Bottom 0.254: v20.85,22.55 20.7,22.4
N$23  (via drill 0.35)
  Top 0.127: U7.5 43.72,19.21 43.72,19 43.51,18.79 v43.51,18.19
  Bottom 0.127: v43.51,18.19 43.74,18.19 C40.2
N$26  (via drill 0.35)
  Top 0.127: C18.P$2 v10.75,22.25
  Bottom 0.127: U1.23 13.02,21.95 12.41,21.95 12.19,21.73 11.67,21.73 R24.P$1
  Bottom 0.61: R24.P$1 v10.75,22.25 C18.P$2
N$27  (via drill 0.35)
  Top 0.203: v8.4,22.05 L6.P$1
  Bottom 0.203: U1.25 9.12,22.8 9.1,22.78 8.99,22.78 8.4,22.19 v8.4,22.05
N$28
  Bottom 0.127: R40.2 49.97,2.82 55.43,2.82 57.3,0.95 70.23,0.95 72.25,2.97 72.25,3.7 71.12,4.83 D4.P$2
N$29
  Top 0.254: UBLOX_GPS.25 62.8,25.85 R15.2
N$30
  Top 0.254: UBLOX_GPS.26 61.1,25.1 R17.1
N$31
  Bottom 0.61: C31.P$2 R28.P$1
N$32
  Bottom 0.127: R42.2 50.21,2.22 50.53,2.54 55.31,2.54 57.2,0.65 70.32,0.65 72.64,2.98 72.64,3.76 73.72,4.83 D4.P$3
N$33
  Bottom 0.127: R41.2 50.63,2.29 55.18,2.29 57.12,0.35 70.38,0.35 73.35,3.33 D4.P$4
N$34
  Top 0.508: UBLOX_GPS.17 UBLOX_GPS.16
N$35  (via drill 0.35)
  Top 0.203: U$5.EXTCOMIN v38.25,7.97 | v38,10.35 U9.6
  Bottom 0.203: v38.25,7.97 38,8.22 v38,10.35
N$37
  Top 0.254: UBLOX_GPS.23 64.8,25.45 R18.1
N$38
  Top 0.254: UBLOX_GPS.24 63.8,25.9 R19.1
N$40
  Top 0.203: U9.3 36.82,13.85 R39.1
N$41
  Top 0.305: U5.1 38.2,17.8 C36.1
N$42  (via drill 0.35)
  Top 0.15: R44.2 39.2,12.7 v39.25,12.75
  Top 0.152: v37.5,14.7 U9.2
  Bottom 0.152: R45.1 37.93,12.67 37.93,12.77 37.5,13.2 v37.5,14.7
  Bottom 0.203: R45.1 38.75,12.25 v39.25,12.75
N$43
  Bottom 0.15: 15.45,18 15.45,18.24 17.34,20.12 17.34,20.7 17.23,20.8 U1.12
  Bottom 0.61: R29.P$2 15.45,18 C33.P$2
N$44  (via drill 0.35)
  Top 0.203: v17.74,17.85 C32.P$2
  Bottom 0.203: R29.P$1 v17.74,17.85
N$47  (via drill 0.25 pad 0.55)
  Top 0.203: C34.P$2 13.9,29.35 v14.4,29.35
  Bottom 0.203: U2.11 13.73,29.35 v14.4,29.35
N$50
  Top 0.305: J5.P$2 31.92,19.55 U5.9
N$51
  Top 0.305: U5.7 32,20.55 31.45,21.1 J5.P$1
SD_CLK  (via drill 0.35)
  Top 0.203: v19.72,1.31 19.57,1.46 13.46,1.46 9.36,5.58 9.36,9.34 8.7,10 v7,10 6.84,10.16 J9.5
  Bottom 0.203: ESP32-PICO-D4.35 19.85,5.15 20.07,4.93 20.07,1.71 v19.72,1.31
  Bottom 0.305: R14.1 7.45,9.55 v7,10 | ESP32-PICO-D4.35
SD_CS  (via drill 0.35)
  Top 0.203: v19.7,0.55 19.59,0.44 13.51,0.44 6.95,7 v6.7,7 5.03,7 J9.2
  Bottom 0.203: ESP32-PICO-D4.34 20,5.65 20.55,5.1 20.55,1.4 v19.7,0.55
  Bottom 0.305: R12.1 7.15,6.55 v6.7,7
SD_MISO  (via drill 0.35)
  Top 0.203: v18.38,2.12 18.07,1.82 13.62,1.82 9.69,5.76 9.69,9.96 7.5,12.15 v6.3,12.15 6.09,12.36 J9.7
  Bottom 0.203: v18.38,2.12 18.56,2.3 ESP32-PICO-D4.38
  Bottom 0.305: R43.1 7.35,11.1 v6.3,12.15 | ESP32-PICO-D4.38
SD_MOSI  (via drill 0.35)
  Top 0.2: 13.6,0.85 v6.6,7.85
  Top 0.203: v19.1,0.95 19,0.85 13.6,0.85 | J9.3 6.49,7.96 v6.6,7.85
  Bottom 0.203: ESP32-PICO-D4.36 19.71,4.5 19.71,2.06 19.1,1.45 v19.1,0.95
  Bottom 0.305: R13.1 6.8,8.05 v6.6,7.85
SW1  (via drill 0.35)
  Top 0.127: v27.9,17.2 21.5,17.2 20.65,16.35 11.95,16.35 10.05,14.45 10.05,8.02 11.44,6.63 v12.13,6.63 | v50.6,1.5 50.1,1.5 45.9,5.7 28.9,5.7 v28.2,5
  Top 0.305: R32.1 50.75,1.65 v50.6,1.5
  Bottom 0.127: ESP32-PICO-D4.5 13,6.68 12.19,6.68 v12.13,6.63 | v28.2,5 27.45,5.75 27.45,16.75 v27.9,17.2
  Bottom 0.305: v50.6,1.5 50.85,1.25 S1.2
SW2  (via drill 0.35)
  Top 0.127: v12.57,7.15 v12.57,7.16 11.46,7.16 10.35,8.27 10.35,14.35 12.1,16.1 20.75,16.1 21.56,16.9 27.45,16.9 27.82,16.53 34.32,16.53 v34.6,16.25
  Bottom 0.127: ESP32-PICO-D4.6 13,7.12 12.61,7.12 v12.57,7.15
  Bottom 0.15: 27.4,37.05 27.4,34.06 34.6,26.86 v34.6,16.25
  Bottom 0.152: S2.2 53.51,38.75 51.96,37.2 42.64,37.2 42.34,37.5 41.69,37.5 40.45,36.26 31,36.26 30.11,37.15 27.4,37.15 27.4,37.05
  Bottom 0.508: R33.1 55.85,38.75 S2.2
SW3  (via drill 0.35)
  Top 0.127: v12.05,7.67 10.65,9.08 10.65,14.29 12.2,15.84 20.86,15.84 21.62,16.6 27.35,16.6 28.05,15.9 33.03,15.9 v33.18,16.05 | R34.1 27.35,38.95 v27.35,39.15
  Bottom 0.127: ESP32-PICO-D4.7 12.08,7.65 v12.05,7.67 | v27.35,39.15 26.93,38.73 26.73,38.73
  Bottom 0.15: v33.18,16.05 33.18,27.5 26.8,33.88
  Bottom 0.152: 26.73,38.73 S3.2 26.8,38.65 26.8,33.88
SW4  (via drill 0.35)
  Top 0.127: v12.51,8.18 10.9,9.79 10.9,14.15 12.34,15.59 21,15.59 21.71,16.3 27.13,16.3 27.85,15.58 33.5,15.58 33.9,15.98 v33.9,16.05
  Top 0.406: R35.1 41.85,38.55 v41.3,38.55
  Bottom 0.127: ESP32-PICO-D4.8 12.54,8.15 v12.51,8.18
  Bottom 0.15: 27.1,37 27.1,33.97 33.9,27.17 v33.9,16.05
  Bottom 0.152: S4.2 40.48,38.52 38.55,36.6 31.29,36.6 30.45,37.43 27.1,37.43 27.1,37
  Bottom 0.406: v41.3,38.55 40.5,38.55 40.48,38.52
V_BAT  (via drill 0.25 pad 0.55, 0.35)
  Top 0.127: 69,15.4 69,14.89 | v23.79,10.11 24.26,9.64 40.43,9.64 44.81,14.02 68.12,14.02
  Top 0.15: 69,14.89 68.12,14.02
  Top 0.254: v13.3,27.55 13.45,27.55 15,29.1 15,29.85 v14.9,29.95
  Top 0.305: v25.21,20.73 26.64,22.15 32.8,22.15 U5.6 34.65,21.05 35,20.7 35,19.4 34.65,19.05 U5.10 33.91,17.8 C37.2 | UBLOX_GPS.8 69,15.4
  Top 0.508: C35.P$2 10.4,30.55 v10.05,30.2
  Bottom 0.127: U2.7 10.9,30.6 11.5,31.2 13.83,31.2 14.31,30.72 14.31,29.98 14.19,29.86 | U2.10
  Bottom 0.15: U2.1 10.68,28.24 10.32,28.24 10.13,28.42 10.13,29.98 10.32,30.16 10.68,30.16 U2.6
  Bottom 0.152: 14.12,29.8 14.07,29.8 | 14.07,29.8 U2.10 | 14.19,29.86 14.14,29.86 14.07,29.8
  Bottom 0.2: v25.21,20.73 25.16,20.68 25.16,13.52 23.79,12.16 v23.79,10.11
  Bottom 0.203: v10.05,30.2 U2.6 U2.7 | 14.12,29.8 14.27,29.95
  Bottom 0.254: U1.32 13.3,26.43 v13.3,27.55 | 14.27,29.95 v14.9,29.95
  Bottom 0.406: v14.9,29.95 21.39,29.95 25.21,26.13 v25.21,20.73
  Bottom 0.61: BATTERY1.2 8.4,32.6 9,32 9,31.25 9.65,30.6 U2.7
  pour Bottom: 11,30.2 9.55,30.2 9.55,31.05 11,31.05
V_LCD  (via drill 0.35)
  Top 0.203: U9.1 39.03,14.02 R44.1
  Top 0.305: U$5.DISP U$5.VDDA U$5.VDD U$5.EXTMODE | R44.1 39.2,13.9 v39.9,14.6
  Top 0.406: v37.98,24.87 37.08,25.77 23.45,25.77 v22.45,24.77
  Top 0.508: U$5.VDDA v39.25,7.95 43,7.95 43.25,7.7 C19.2
  Bottom 0.203: U1.6 16.93,23 U1.7
  Bottom 0.305: v39.25,7.95 42.61,4.59 J8.2
  Bottom 0.406: C29.P$2 20.6,24.45 20.92,24.77 v22.45,24.77 | v37.98,24.87 39.9,22.95 v39.9,14.6 39.9,8.6 v39.25,7.95
  Bottom 0.61: C29.P$2 R9.P$2 C11.P$2 16.93,23
V_REG  (via drill 0.35, 0.35 pad 0.55)
  Top 0.152: v22.16,23.95 21.96,24.15 21.96,25.02 20,26.99 20,27
  Top 0.203: v14,19.22 15.32,19.22 v15.6,19.5 | 20,27 20,28.98 L2.1
  Top 0.254: v12,21.2 12.45,21.2 C27.P$2 | v12.05,22.25 13.05,23.25 C26.P$2 | v12.1,23.65 13.05,24.6 C25.P$2
  Top 0.305: L5.P$2 v17.7,25.1
  Top 0.406: L5.P$2 16.34,25.85 16.1,26.1 15.19,27 15.19,27.02 14.87,27.35 v14.45,27.35 13.96,27.35 13.55,26.94 13.54,26.94 C12.P$2
  Top 0.508: C28.P$2 14.85,20.25 v15.6,19.5 15.32,19.79 15.32,24.29 15.66,24.63 15.66,25.66 16.1,26.1
  Top 0.61: L2.1 20.02,28.02 17.85,25.85 L5.P$2 | C12.P$2 C25.P$2 C26.P$2 C27.P$2
  Bottom 0.15: 12.15,21.2 11.88,21.47 8.31,21.47 5.57,24.2 R21.P$2
  Bottom 0.2: v22.16,23.95 22.05,23.84 VREG_MODE.3
  Bottom 0.203: U1.1 U1.2 U1.3 | U1.14 U1.15 15.6,19.86 | v14,19.22 14.2,19.43 U1.18
  Bottom 0.254: U1.22 12.55,21.6 12.15,21.2 v12,21.2 | v12.05,22.25 12.2,22.4 U1.24 | U1.27 12.15,23.6 v12.1,23.65 | U1.34 14.6,27.2 v14.45,27.35
  Bottom 0.305: U1.2 17.23,25.1 v17.7,25.1
  Bottom 0.61: v15.6,19.5 15.6,19.86
  pour Top: 12,27 18,27 18,31 21,31 21,27 18,24 18,19 12,19
V_USB  (via drill 0.35)
  Top 0.406: v15.8,27.25 15.51,27.54 15.51,30.79 14.2,32.1 11.5,32.1 11.3,32.3 v11.3,32.75 | J1.1 4.35,32.95 5.25,33.85 5.25,35.75 | C9.P$1 5.25,36.9 5.25,35.75 | v6,36.5 5.25,35.75
  Top 0.508: FT231.15 11.52,35.91 C7.1 v11.2,35.6
  Bottom 0.203: U1.35 15.24,25.93 U1.36
  Bottom 0.406: v11.3,32.75 11.3,35.5 v11.2,35.6 10.65,36.15 6.35,36.15 v6,36.5
  Bottom 0.61: v15.8,27.25 15.75,27.25 15.24,26.74 15.24,25.93
VCC  (via drill 0.35)
  Top 0.127: v29.85,36.6 29.5,36.25 26.2,36.25 25.55,36.9 25.55,37.85 R34.2
  Top 0.2: R10.2 30.15,31.55 30.15,31.3 30.23,31.23 v30.98,31.23
  Top 0.203: v41.46,19.73 40.73,19 v40.51,19
  Top 0.254: v20.27,10.03 21.98,10.03 22.7,9.3 40.75,9.3 v41.6,10.15
  Top 0.305: v12.56,4.55 12.55,4.56 v12.55,5.95 | v19.07,3.55 18.2,4.42 18.2,8.2 20.02,10.03 v20.27,10.03 | v70,2 68.55,0.55 54.4,0.55 53.85,1.1 R32.2 52.85,0.65 50.05,0.65 47.06,3.64 30.04,3.64 C23.1 | v29.85,36.6 31.6,36.6 32.44,37.44 J4.2 | U7.10 44.76,20.71 U7.9 U7.2 U7.3 42.99,20 41.73,20 v41.46,19.73
  Top 0.406: BME280.2 27.38,1.52 | 27.38,1.58 27.38,1.52 | R38.2 25.34,2.85 26.29,1.9 27.06,1.9 27.38,1.58 | BME280.6 26.71,2.27 27.38,1.61 27.38,1.58 | 27.38,1.52 28.02,2.17 BME280.8 29.26,3.12 C23.1 | R35.2 41.7,37 v42,37
  Top 0.508: R37.2 22.55,3.55 v19.07,3.55 | v10.8,15.95 11.7,16.85 v12.2,16.85 | v11.38,12.28 12.96,10.69 13.85,10.69 13.85,7.25 v12.55,5.95 | v16.05,3 16.4,3.35 16.4,3.93 16.65,4.18 16.65,11.04 v16.55,11.14
  Top 0.61: v20.4,16.9 20.1,16.9 R28.P$2
  Top 0.813: R37.2 R38.2 | R10.2 R11.2
  Bottom 0.127: R33.2 55.5,36.7 42.3,36.7 v42,37 | 42,36.9 41.05,35.95 30.45,35.95 29.85,36.55 v29.85,36.6
  Bottom 0.203: U1.17 14.69,20.07 U1.16 | 70.89,2.88 D4.P$1 | ESP32-PICO-D4.19 v16.55,11.14 | v40.51,19 40.45,19.06 40.45,20
  Bottom 0.254: v41.6,10.15 40.45,11.3 40.45,20 40.45,23.7 v39.8,24.35 32.92,31.23 v30.98,31.23
  Bottom 0.305: ESP32-PICO-D4.3 ESP32-PICO-D4.4 12.84,5.95 v12.55,5.95 | v12.56,4.55 12.66,4.65 ESP32-PICO-D4.1 13.05,3.85 13.27,3.63 14.33,3.63 14.55,3.85 ESP32-PICO-D4.46 14.55,3.85 14.77,3.63 15.83,3.63 16.05,3.85 ESP32-PICO-D4.43 v16.05,3 16.05,2.4 16.9,1.55 18.6,1.55 19.05,2 ESP32-PICO-D4.37 19.07,4.12 v19.07,3.55 | ESP32-PICO-D4.26 19.9,9.65 v20.27,10.03 20.9,10.65 C38.2 | v70,2 70.89,2.88 | v30.98,31.23 30.98,35.42 29.85,36.55 | v41.46,19.73 42.04,19.15 C39.1
  Bottom 0.508: 14.69,20.07 14.69,19.97 14.71,19.95 14.71,16.5 14.99,16.22 | v20.4,16.9 19.59,16.9 18.91,16.22 14.99,16.22 | v16.05,3 | 14.99,16.22 12.83,16.22 v12.2,16.85 | v10.8,15.95 10.8,14.54 10.74,14.6 10.74,12.73 11,12.47 R1.2 11,11.9 v11.38,12.28 | 42,36.9 v42,37
  Bottom 0.61: R26.P$2 19.95,18.5 R28.P$2 20.1,16.9 v20.4,16.9 21.19,16.9 R2.2
  Bottom 1.016: C38.2 C8.2
  pour Top: 10,17 22,17 22,13 18,9 18,2.3 13.7,2.3 10,6

## Text on the board
tNames: Hikebuddy 2.0 / Dhauladhar | 2020 / Saurabh Gandhi | LCD / GPIO Extension
tValues: RX | TX | ESP_RX | ESP_TX | GND | VCC | GND | SDA | SCL | GND | GPIO/ / Flash | I2C Extension | RESET | V_GPS / (3.3V) | SAFEBOOT | GPS / UART Extension | GPIO14 | GPIO13 | GPIO15 | VCC (LCD) | GND | GPIO0/ / FLASH